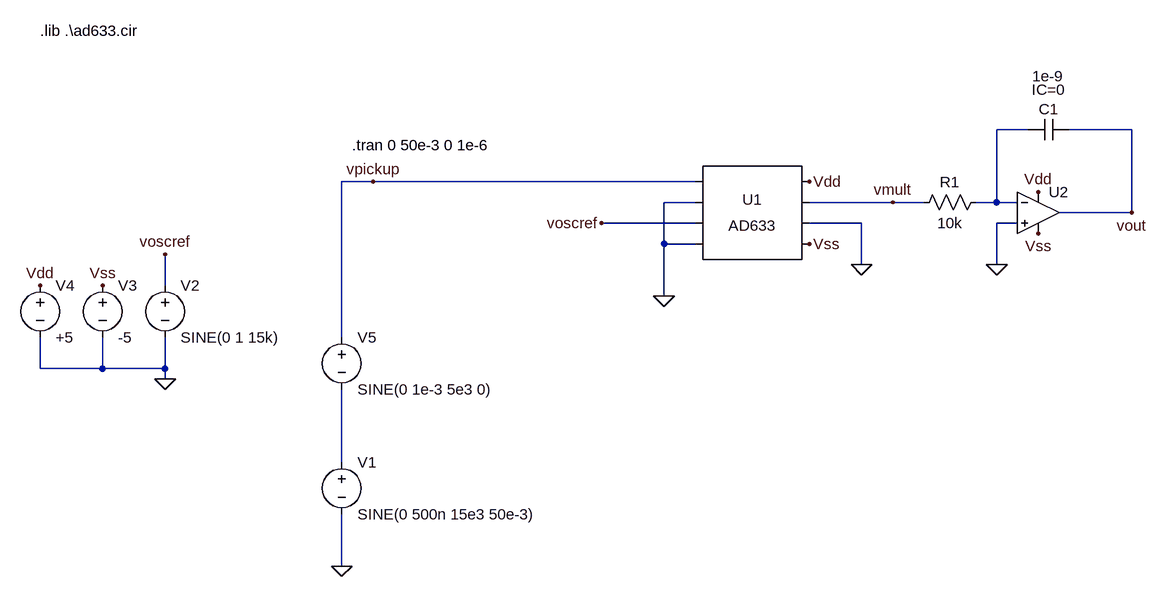
[diagram p0: schematic pre_filter.asc]
pre_filter.asc, the LTspice schematic file:
Version 4
SHEET 1 1088 5216
WIRE 704 -32 656 -32
WIRE 864 -32 768 -32
WIRE -304 48 -352 48
WIRE 192 48 -304 48
WIRE 192 80 144 80
WIRE 496 80 368 80
WIRE 544 80 496 80
WIRE 656 80 656 -32
WIRE 656 80 624 80
WIRE 688 80 656 80
WIRE 864 96 864 -32
WIRE 864 96 752 96
WIRE 192 112 48 112
WIRE 448 112 368 112
WIRE 688 112 656 112
WIRE 144 144 144 80
WIRE 192 144 144 144
WIRE 448 176 448 112
WIRE 656 176 656 112
WIRE -624 208 -624 160
WIRE 144 224 144 144
WIRE -352 288 -352 48
WIRE -816 336 -816 288
WIRE -720 336 -720 288
WIRE -720 336 -816 336
WIRE -624 336 -624 288
WIRE -624 336 -720 336
WIRE -624 352 -624 336
WIRE -352 480 -352 368
WIRE -352 640 -352 560
FLAG -624 352 0
FLAG -624 160 voscref
FLAG -816 208 Vdd
FLAG -720 208 Vss
FLAG 144 224 0
FLAG 48 112 voscref
FLAG 368 144 Vss
FLAG 368 48 Vdd
FLAG 448 176 0
FLAG -304 48 vpickup
FLAG 496 80 vmult
FLAG 656 176 0
FLAG 720 64 Vdd
FLAG 720 128 Vss
FLAG -352 640 0
FLAG 864 96 vout
SYMBOL voltage -624 192 R0
WINDOW 123 0 0 Left 0
WINDOW 39 0 0 Left 0
SYMATTR InstName V2
SYMATTR Value SINE(0 1 15k)
SYMBOL voltage -720 192 R0
WINDOW 123 0 0 Left 0
WINDOW 39 0 0 Left 0
SYMATTR InstName V3
SYMATTR Value -5
SYMBOL voltage -816 192 R0
WINDOW 123 0 0 Left 0
WINDOW 39 0 0 Left 0
SYMATTR InstName V4
SYMATTR Value +5
SYMBOL voltage -352 272 R0
WINDOW 123 0 0 Left 0
WINDOW 39 0 0 Left 0
SYMATTR InstName V5
SYMATTR Value SINE(0 1e-3 5e3 0)
SYMBOL Opamps\\UniversalOpamp2 720 96 R0
SYMATTR InstName U2
SYMBOL res 640 64 R90
WINDOW 0 0 56 VBottom 2
WINDOW 3 32 56 VTop 2
SYMATTR InstName R1
SYMATTR Value 10k
SYMBOL cap 768 -48 R90
WINDOW 0 0 32 VBottom 2
WINDOW 3 -82 33 VTop 2
WINDOW 39 -30 32 VBottom 2
SYMATTR InstName C1
SYMATTR Value 1e-9
SYMATTR SpiceLine IC=0
SYMBOL voltage -352 464 R0
WINDOW 123 0 0 Left 0
WINDOW 39 0 0 Left 0
SYMATTR InstName V1
SYMATTR Value SINE(0 500n 15e3 50e-3)
SYMBOL AutoGenerated\\AD633 272 96 R0
SYMATTR InstName U1
TEXT -336 -8 Left 2 !.tran 0 50e-3 0 1e-6
TEXT -816 -184 Left 2 !.lib .\\ad633.cir

The netlist it stands for:
* pre_filter.asc
V2 voscref 0 SINE(0 1 15k)
V3 Vss 0 -5
V4 Vdd 0 +5
V5 vpickup N002 SINE(0 1e-3 5e3 0)
XU2 0 N001 Vdd Vss vout level.2 Avol=1Meg GBW=10Meg Slew=10Meg ilimit=25m rail=0 Vos=0 phimargin=45 en=0 enk=0 in=0 ink=0 Rin=500Meg  ; pins IN+ IN- V+ V- OUT
R1 N001 vmult 10k
C1 vout N001 1e-9 IC=0
V1 N002 0 SINE(0 500n 15e3 50e-3)
* U1: AD633 (symbol AutoGenerated\AD633 not available, pins judged from their places): pin1=vpickup pin2=0 pin3=voscref pin4=0 pin5=Vdd pin6=vmult pin7=0 pin8=Vss
.tran 0 50e-3 0 1e-6
.lib .\ad633.cir
.lib UniversalOpamps2.sub
.backanno
.end